# Altium schematic sheet USB_Serial_Quad.SchDoc: Kasli-DIOT
size 420 x 297 mm; EDA_Number: ARTIQ; Projet: ARTIQ/SINARA; Author: G.Kasprowicz; CompanyName: WUT ISE; DrawnBy: F.Świtakowski; Organization: WUT ISE; Address1: PW ISE; Address2: Nowowiejska 15/19 00-665 Warsaw; Address3: gkasprow@gmail.com; DocumentNumber: 9; SheetNumber: 9; SheetTotal: 16; ModifiedBy: -; CheckedDate: -; Title2: USB_Serial_Quad; DivGrp: WUT ISE; Designer: F.Świtakowski; ModifiedDate: -; ProjectName: Sensor Box
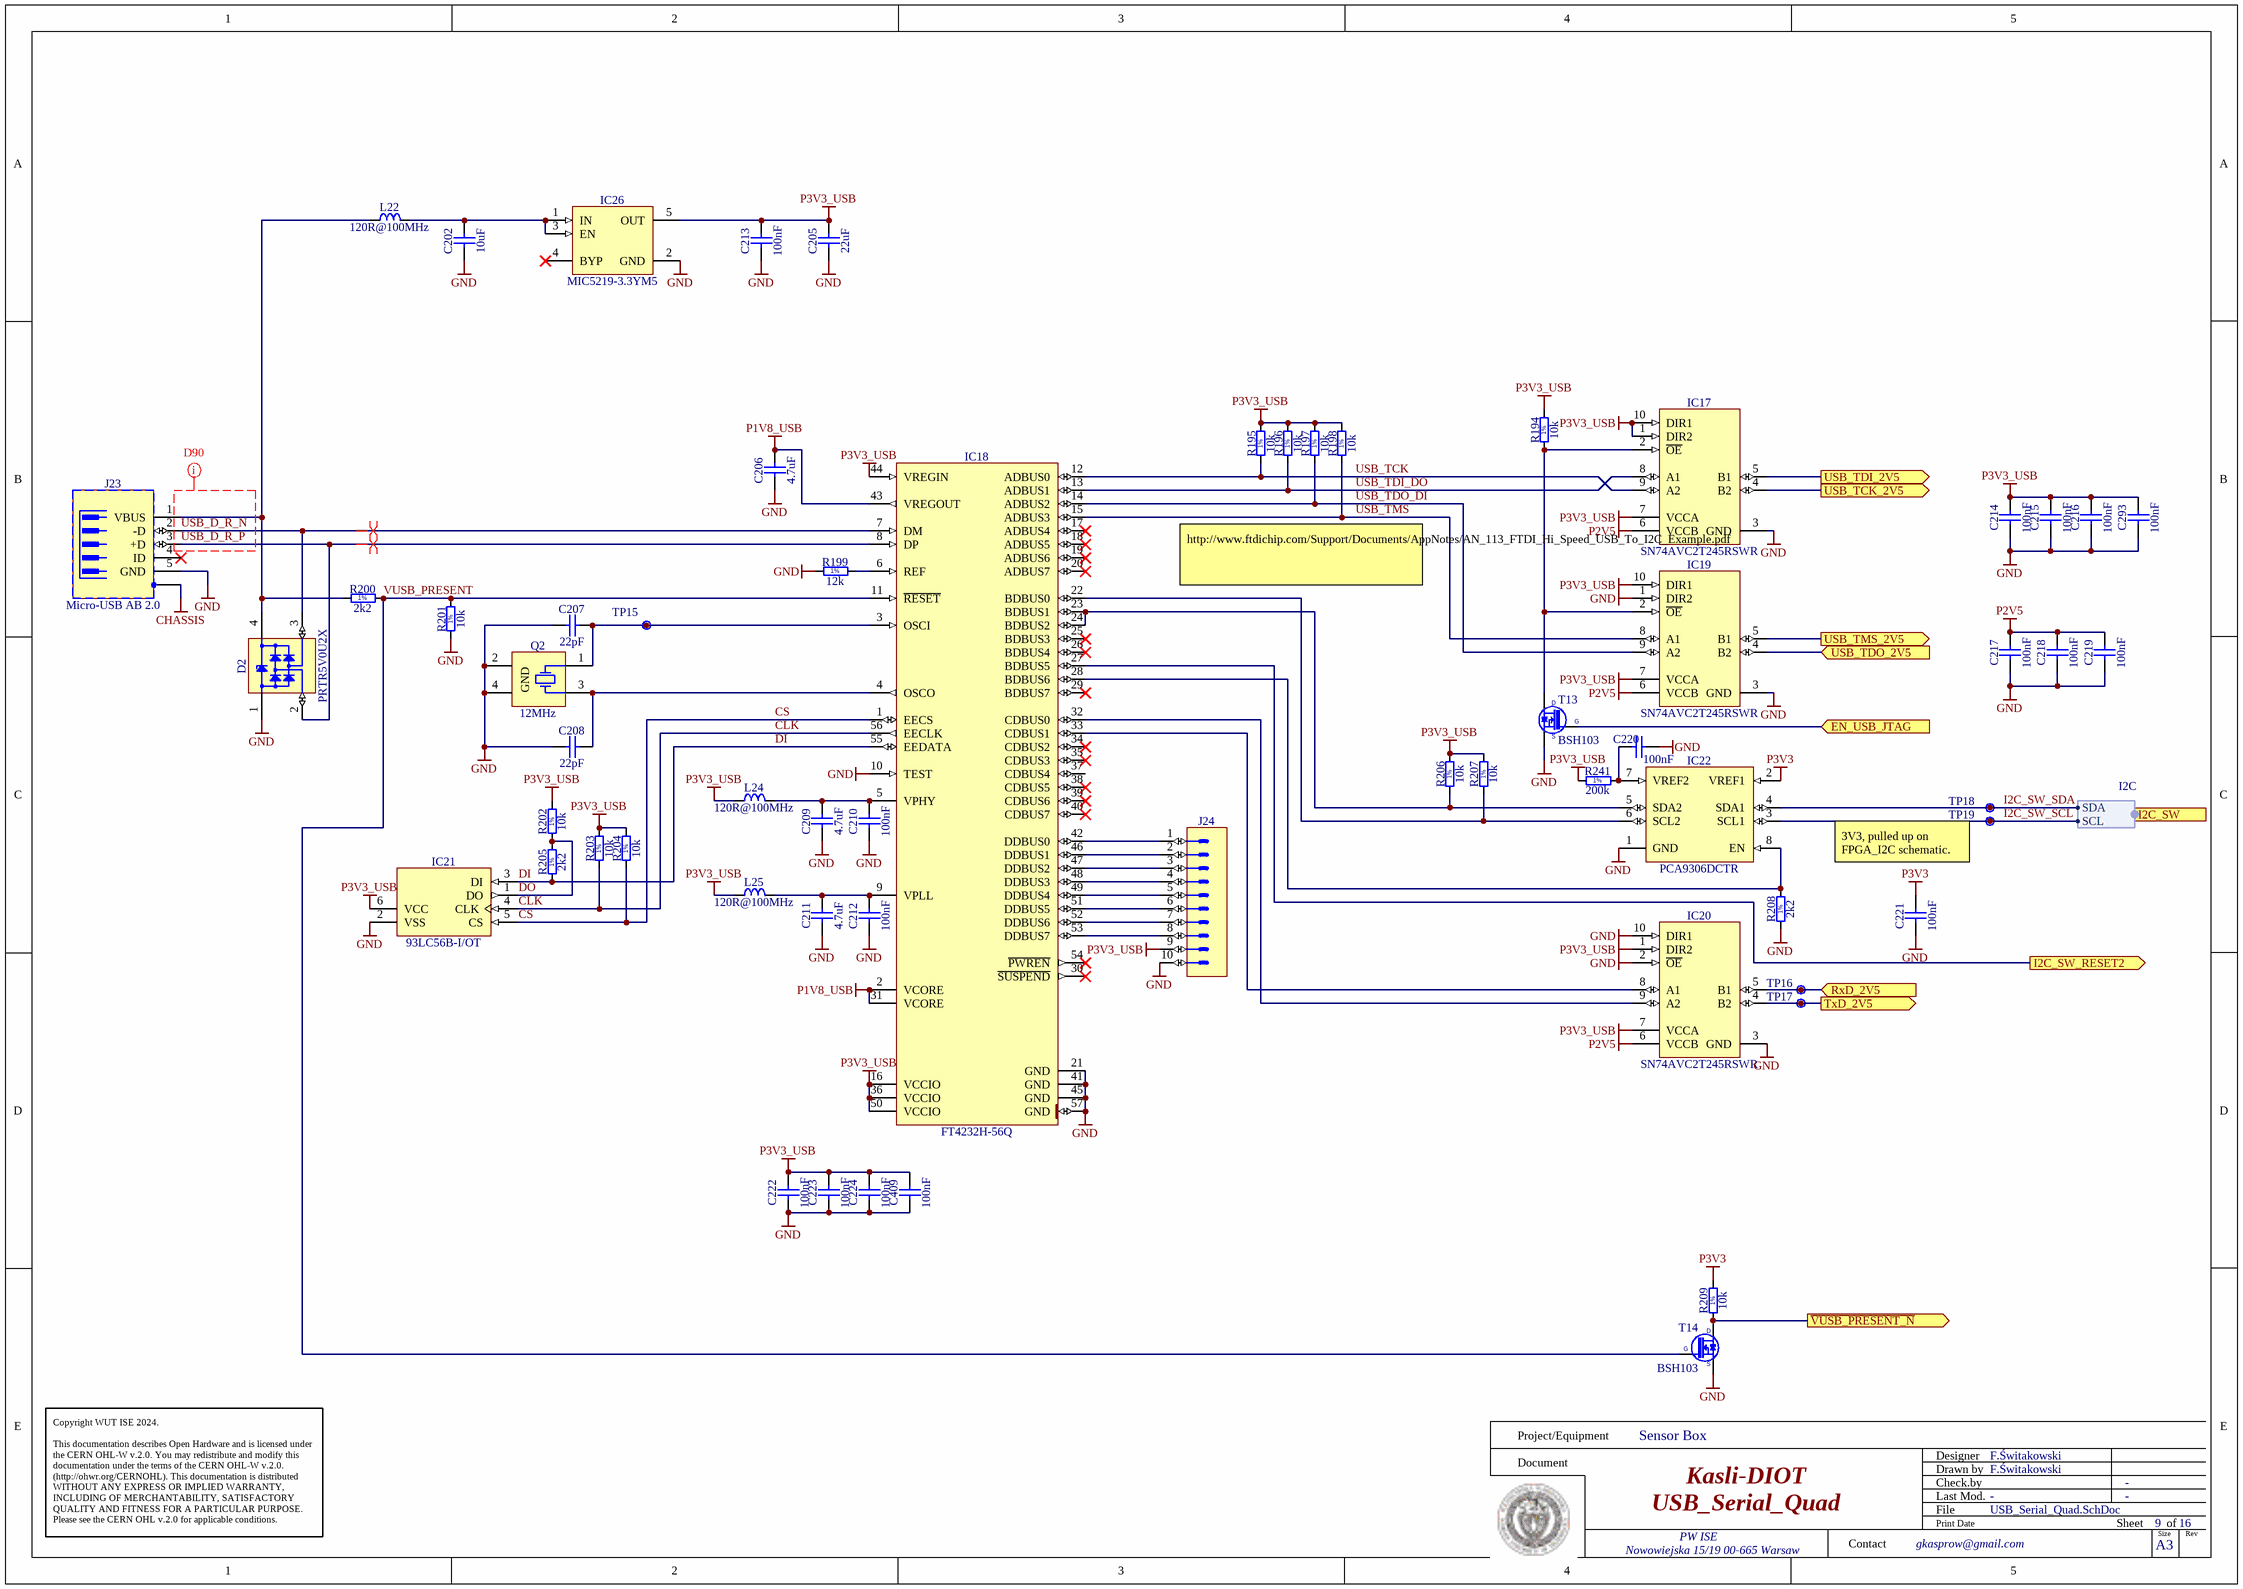
[diagram p0: USB_Serial_Quad.SchDoc]

## Parts
C202  10uF  [CAPC1608X87N]
C205  22uF  [CAPC1709X100N]
C206  4.7uF  [CAPC2012X135N]
C207  22pF  [CAPC1005X55N]
C208  22pF  [CAPC1005X55N]
C209  4.7uF  [CAPC2012X135N]
C210  100nF  [CAPC0603X33N]
C211  4.7uF  [CAPC2012X135N]
C212  100nF  [CAPC0603X33N]
C213  100nF  [CAPC1005X55N]
C214  100nF  [CAPC1005X55N]
C215  100nF  [CAPC1005X55N]
C216  100nF  [CAPC1005X55N]
C217  100nF  [CAPC1005X55N]
C218  100nF  [CAPC1005X55N]
C219  100nF  [CAPC1005X55N]
C220  100nF  [CAPC1005X55N]
C221  100nF  [CAPC1005X55N]
C222  100nF  [CAPC1005X55N]
C223  100nF  [CAPC1005X55N]
C224  100nF  [CAPC1005X55N]
C293  100nF  [CAPC1005X55N]
C409  100nF  [CAPC1005X55N]
D2  PRTR5V0U2X  [SOT190P230X110-4N]
IC17  SN74AVC2T245RSWR  [QFN40P140X180X55-10N]
IC18  FT4232H-56Q  [QFN50P800X800X100-57N-S620]
IC19  SN74AVC2T245RSWR  [QFN40P140X180X55-10N]
IC20  SN74AVC2T245RSWR  [QFN40P140X180X55-10N]
IC21  93LC56B-I/OT  [SOT95P270X145-6N]
IC22  PCA9306DCTR  [SOP65P400X130-8N]
IC26  MIC5219-3.3YM5  [SOT95P280X145-5N]
J23  Micro-USB AB 2.0  [HIROSE_ZX62RD-AB-5P8]
J24  Header 10  [SAMTEC_TSW-105-07-L-D-LL]  (value not drawn)
L22  120R@100MHz  [INDC1608X65N]
L24  120R@100MHz  [INDC1608X65N]
L25  120R@100MHz  [INDC1608X65N]
Q2  12MHz  [XTAL_TXC_7M]
R194  10k  [RESC1005X40N]
R195  10k  [RESC1005X40N]
R196  10k  [RESC1005X40N]
R197  10k  [RESC1005X40N]
R198  10k  [RESC1005X40N]
R199  12k  [RESC1005X40N]
R200  2k2  [RESC1005X40N]
R201  10k  [RESC1005X40N]
R202  10k  [RESC1005X40N]
R203  10k  [RESC1005X40N]
R204  10k  [RESC1005X40N]
R205  2k2  [RESC1005X40N]
R206  10k  [RESC1005X40N]
R207  10k  [RESC1005X40N]
R208  2k2  [RESC1005X40N]
R209  10k  [RESC1005X40N]
R241  200k  [RESC1005X40N]
T13  BSH103  [SOT95P230X110-3N]
T14  BSH103  [SOT95P230X110-3N]
TP15  Test Point  [TPS127]  (value not drawn)  (no BOM)
TP16  Test Point  [TPS127]  (value not drawn)  (no BOM)
TP17  Test Point  [TPS127]  (value not drawn)  (no BOM)
TP18  Test Point  [TPS127]  (value not drawn)  (no BOM)
TP19  Test Point  [TPS127]  (value not drawn)  (no BOM)

## Ports
EN_USB_JTAG (in), I2C_SW (harness i2C), I2C_SW_RESET2 (out), RxD_2V5 (in), TxD_2V5 (out), USB_TCK_2V5 (out), USB_TDI_2V5 (out), USB_TDO_2V5 (in), USB_TMS_2V5 (out), ~{VUSB_PRESENT_N} (out)

## Harnesses
I2C: SDA, SCL

## Nets
CHASSIS: J23.6(SH)
GND: C202.1 C205.1 C206.1 C207.1 C208.1 C209.1 C210.1 C211.1 C212.1 C213.1 C214.1 C215.1 C216.1 C217.1 C218.1 C219.1 C220.2 C221.1 C222.1 C223.1 C224.1 C293.1 C409.1 D2.1(GND) IC17.3(GND) IC18.10(TEST) IC18.21(GND) IC18.41(GND) IC18.45(GND) IC18.57(GND) IC19.1(DIR2) IC19.3(GND) IC20.2(~{OE}) IC20.3(GND) IC20.10(DIR1) IC21.2(VSS) IC22.1(GND) IC26.2(GND) J23.5(GND) J24.10 Q2.2(GND) Q2.4(GND) R199.1 R201.1 R208.1 T13.2(S) T14.2(S)
P1V8_USB: C206.2 IC18.2(VCORE) IC18.31(VCORE) IC18.43(VREGOUT)
P2V5: C217.2 C218.2 C219.2 IC17.6(VCCB) IC19.6(VCCB) IC20.6(VCCB)
P3V3: C221.2 IC22.2(VREF1) R209.2
P3V3_USB: C205.2 C213.2 C214.2 C215.2 C216.2 C222.2 C223.2 C224.2 C293.2 C409.2 IC17.1(DIR2) IC17.7(VCCA) IC17.10(DIR1) IC18.16(VCCIO) IC18.36(VCCIO) IC18.44(VREGIN) IC18.50(VCCIO) IC19.7(VCCA) IC19.10(DIR1) IC20.1(DIR2) IC20.7(VCCA) IC21.6(VCC) IC26.5(OUT) J24.9 L24.1 L25.1 R194.2 R195.2 R196.2 R197.2 R198.2 R202.2 R203.2 R204.2 R206.2 R207.2 R241.1
~{VUSB_PRESENT_N}: R209.1 T14.3(D) ; port ~{VUSB_PRESENT_N}
CLK: IC18.56(EECLK) IC21.4(CLK) R203.1
CS: IC18.1(EECS) IC21.5(CS) R204.1
DI: IC18.55(EEDATA) IC21.3(DI) R205.2
DO: IC21.1(DO) R202.1 R205.1
EN_USB_JTAG: T13.1(G) ; port EN_USB_JTAG
I2C_SW_RESET2: IC18.27(BDBUS5) ; port I2C_SW_RESET2
I2C_SW_SCL: IC22.3(SCL1) TP19.1 ; port I2C_SW.SCL
I2C_SW_SDA: IC22.4(SDA1) TP18.1 ; port I2C_SW.SDA
RxD_2V5: IC20.5(B1) TP16.1 ; port RxD_2V5
TxD_2V5: IC20.4(B2) TP17.1 ; port TxD_2V5
USB_D_R_N: D2.3(I/O2) IC18.7(DM) J23.2(-D)
USB_D_R_P: D2.2(I/O1) IC18.8(DP) J23.3(+D)
USB_TCK: IC17.9(A2) IC18.12(ADBUS0) R195.1
USB_TCK_2V5: IC17.4(B2) ; port USB_TCK_2V5
USB_TDI_2V5: IC17.5(B1) ; port USB_TDI_2V5
USB_TDI_DO: IC17.8(A1) IC18.13(ADBUS1) R196.1
USB_TDO_2V5: IC19.4(B2) ; port USB_TDO_2V5
USB_TDO_DI: IC18.14(ADBUS2) IC19.9(A2) R197.1
USB_TMS: IC18.15(ADBUS3) IC19.8(A1) R198.1
USB_TMS_2V5: IC19.5(B1) ; port USB_TMS_2V5
VUSB_PRESENT: IC18.11(~{RESET}) R200.2 R201.2 T14.1(G)
NetC202_2: C202.2 IC26.1(IN) IC26.3(EN) L22.2
NetC207_2: C207.2 IC18.3(OSCI) Q2.1(X) TP15.1
NetC208_2: C208.2 IC18.4(OSCO) Q2.3(X)
NetC209_2: C209.2 C210.2 IC18.5(VPHY) L24.2
NetC211_2: C211.2 C212.2 IC18.9(VPLL) L25.2
NetC220_1: C220.1 IC22.7(VREF2) R241.2
NetD2_4: D2.4(VCC) J23.1(VBUS) L22.1 R200.1
NetIC17_2: IC17.2(~{OE}) IC19.2(~{OE}) R194.1 T13.3(D)
NetIC18_6: IC18.6(REF) R199.2
NetIC18_22: IC18.22(BDBUS0) IC22.6(SCL2) R207.1
NetIC18_23: IC18.23(BDBUS1) IC18.24(BDBUS2) IC22.5(SDA2) R206.1
NetIC18_28: IC18.28(BDBUS6) IC22.8(EN) R208.2
NetIC18_32: IC18.32(CDBUS0) IC20.9(A2)
NetIC18_33: IC18.33(CDBUS1) IC20.8(A1)
NetIC18_42: IC18.42(DDBUS0) J24.1
NetIC18_46: IC18.46(DDBUS1) J24.2
NetIC18_47: IC18.47(DDBUS2) J24.3
NetIC18_48: IC18.48(DDBUS3) J24.4
NetIC18_49: IC18.49(DDBUS4) J24.5
NetIC18_51: IC18.51(DDBUS5) J24.6
NetIC18_52: IC18.52(DDBUS6) J24.7
NetIC18_53: IC18.53(DDBUS7) J24.8

Not connected (* = marked no-connect by the designer): IC18 17(ADBUS4)* 18(ADBUS5)* 19(ADBUS6)* 20(ADBUS7)* 25(BDBUS3)* 26(BDBUS4)* 29(BDBUS7)* 30(~{SUSPEND})* 34(CDBUS2)* 35(CDBUS3)* 37(CDBUS4) 38(CDBUS5)* 39(CDBUS6)* 40(CDBUS7)* 54(~{PWREN})*; IC26 4(BYP)*; J23 4(ID)*

## Layout directives
net class D90: USB_D_R_N, USB_D_R_P
differential pair: USB_D_R_N, USB_D_R_P

## Notes on the sheet
- http://www.ftdichip.com/Support/Documents/AppNotes/AN_113_FTDI_Hi_Speed_USB_To_I2C_Example.pdf
- 3V3, pulled up on FPGA_I2C schematic.
- Project/Equipment
- Document
- Designer
- Drawn by
- Check.by
- Copyright WUT ISE 2024.
  This documentation describes Open Hardware and is licensed under the CERN OHL-W v.2.0. You may redistribute and modify this documentation under the terms of the CERN OHL-W v.2.0. (http://ohwr.org/CERNOHL). This documentation is distributed WITHOUT ANY EXPRESS OR IMPLIED WARRANTY, INCLUDING OF MERCHANTABILITY, SATISFACTORY QUALITY AND FITNESS FOR A PARTICULAR PURPOSE. Please see the CERN OHL v.2.0 for applicable conditions.
- Contact
- File
- Last Mod.
- Print Date
- Sheet
- Size
- A3
- of
- Rev
- (in symbol R0402_2K2_1%_0.0625W_100PPM) 1%
- (in symbol R0402_10K_1%_0.0625W_100PPM) 1%
- (in symbol R0402_12K_1%_0.0625W_100PPM) 1%
- (in symbol R0402_200K_1%_0.0625W_100PPM) 1%

## Library data of the parts
C202 = CC0603_10UF_6.3V_20%_X5R: Non-polarised capacitor; Part Description: SMD Multilayer Chip Ceramic Capacitor; Manufacturer: GENERIC; Manufacturer1 Part Number: C0603C106M9PAC; Voltage: 6.3V; TC: X5R; Tolerance: ±20%; Part Number: CC0603_10UF_6.3V_20%_X5R; Component Kind: Standard; Component Type: Standard; Pin Count: 2; Value: 10uF; Status: Preferred; Manufacturer Part Number: CC0603_10uF_6.3V_20%_X5R; Case: 0603; Mounted: Yes; Socket: No; SMD: Yes; Sense: No; Manufacturer1 Example: KEMET; Manufacturer1 ComponentHeight: 0.95mm; HelpURL: \\cern.ch\dfs\Applications\Altium\Datasheets\CC0603_X5R_KEMET.pdf; Author: CERN DEM JLC; CreateDate: 2007-12-03; LatestRevisionDate: 2007-12-03
C205 = CC0603_22UF_6.3V_20%_X5R: Non-polarised capacitor; Part Description: SMD Multilayer Chip Ceramic Capacitor; Manufacturer: GENERIC; Manufacturer1 Part Number: C1608X5R0J226M080AC; Voltage: 6.3V; TC: X5R; Tolerance: ±20%; Part Number: CC0603_22UF_6.3V_20%_X5R; Component Kind: Standard; Component Type: Standard; Pin Count: 2; Value: 22uF; Status: None; Manufacturer Part Number: CC0603_22UF_6.3V_20%_X5R; Case: 0603; Mounted: Yes; Socket: No; SMD: Yes; Sense: No; Manufacturer1 Example: TDK; Manufacturer1 ComponentHeight: 1mm; HelpURL: \\cern.ch\dfs\Applications\Altium\Datasheets\CC0603_X5R_TDK_C.pdf; Author: CERN DEM JLC; CreateDate: 16.12.2013; LatestRevisionDate: 13.09.2016; ClassName: Artix
C206 C209 C211 = CC0805_4.7UF_10V_10%_X5R: Non-polarised capacitor; Part Description: SMD Multilayer Chip Ceramic Capacitor; Manufacturer: GENERIC; Manufacturer1 Part Number: 222224013672; Voltage: 10V; TC: X5R; Tolerance: ±10%; Part Number: CC0805_4.7UF_10V_10%_X5R; Component Kind: Standard; Component Type: Standard; Pin Count: 2; Value: 4.7uF; Status: Preferred; Manufacturer Part Number: CC0805_4.7UF_10V_10%_X5R; Case: 0805; Mounted: Yes; Socket: No; SMD: Yes; Sense: No; Manufacturer1 Example: PHYCOMP; Manufacturer1 ComponentHeight: 1.45mm; HelpURL: \\cern.ch\dfs\Applications\Altium\Datasheets\CC0805_X5R_PHYCOMP_HC.pdf; Author: CERN DEM JLC; CreateDate: 03.12.2007; LatestRevisionDate: 03.12.2007
C207 C208 = CC0402_22PF_50V_5%_C0G: Non-polarised capacitor; Part Description: SMD Multilayer Chip Ceramic Capacitor; Manufacturer: GENERIC; Manufacturer1 Part Number: C0402C220J5GACTU; Voltage: 50V; TC: C0G/NP0; Tolerance: ±5%; Part Number: CC0402_22PF_50V_5%_C0G; Component Kind: Standard; Component Type: Standard; Pin Count: 2; Value: 22pF; Status: Preferred; Manufacturer Part Number: CC0402_22PF_50V_5%_C0G; Case: 0402; Mounted: Yes; Socket: No; SMD: Yes; Sense: No; Manufacturer1 Example: KEMET; Manufacturer1 ComponentHeight: 0.55mm; HelpURL: \\cern.ch\dfs\Applications\Altium\Datasheets\CC0805_C0G_KEMET_(Commercial Grade).pdf; Author: CERN DEM JLC; CreateDate: 03.12.2007; LatestRevisionDate: 03.12.2007
C210 C212 = CC0201_100NF_6.3V_10%_X5R: Non-polarised capacitor; Part Description: SMD Multilayer Chip Ceramic Capacitor; Manufacturer: GENERIC; Manufacturer1 Part Number: 02016D104KAT2A; Voltage: 6.3V; TC: X5R; Tolerance: ±10%; Part Number: CC0201_100NF_6.3V_10%_X5R; Component Kind: Standard; Component Type: Standard; Pin Count: 2; Value: 100nF; Status: Not Recommended; Manufacturer Part Number: CC0201_100NF_6.3V_10%_X5R; Case: 0201; Mounted: Yes; Socket: No; SMD: Yes; Sense: No; Manufacturer1 Example: AVX; Manufacturer1 ComponentHeight: 0.33mm; HelpURL: \\cern.ch\dfs\Applications\Altium\Datasheets\CC0201_X5R_AVX.pdf; Author: CERN DEM JLC; CreateDate: 03.12.2007; LatestRevisionDate: 03.12.2007
C213-C224 C293 C409 = CC0402_100NF_16V_10%_X7R: Non-polarised capacitor; Part Description: SMD Multilayer Chip Ceramic Capacitor; Manufacturer: GENERIC; Manufacturer1 Part Number: GRM155R71C104KA88D; Voltage: 16V; TC: X7R; Tolerance: ±10%; Part Number: CC0402_100NF_16V_10%_X7R; Component Kind: Standard; Component Type: Standard; Pin Count: 2; Value: 100nF; Status: Not Recommended; Manufacturer Part Number: CC0402_100NF_16V_10%_X7R; Case: 0402; Mounted: Yes; Socket: No; SMD: Yes; Sense: No; Manufacturer1 Example: MURATA; Manufacturer1 ComponentHeight: 0.55mm; HelpURL: \\cern.ch\dfs\Applications\Altium\Datasheets\CC0402_X7R_MURATA_GRM.pdf; Author: CERN DEM JLC; CreateDate: 05/12/2013; LatestRevisionDate: 03/12/2007
D2 = PRTR5V0U2X: Ultra Low Capacitance Double Rail-to-Rail ESD Protection Diode; Part Description: Ultra Low Capacitance (1pF) Double Rail-to-Rail ESD Protection Diode (8kV); Manufacturer: NXP SEMICONDUCTORS; Voltage: 5.5V; PressFit: No; Bonding: No; Part Number: PRTR5V0U2X; Component Kind: Standard; Component Type: Standard; Device: PRTR5V0U2X; PackageDescription: SOT143B, SOT, 1.90mm Pitch; 4 Pin, 1.30mm W X 2.90mm L X 1.10mm H body, IPC Medium Density; Manufacturer Part Number: PRTR5V0U2X; Pin Count: 4; Case: SOT143B; Mounted: Yes; Socket: No; SMD: Yes; Sense: No; ComponentHeight: 1.1mm; HelpURL: \\cern.ch\dfs\Applications\Altium\Datasheets\PRTR5V0U2X.pdf; Author: CERN DEM JLC; CreateDate: 22.03.2011; LatestRevisionDate: 22.03.2011
IC17 IC19 IC20 = SN74AVC2T245RSWR: Dual-Bit Dual-Supply Bus Transceiver With Configurable Voltage Translation and 3-State Outputs; Manufacturer: TEXAS INSTRUMENTS; PressFit: No; Bonding: No; Part Number: SN74AVC2T245RSWR; Component Kind: Standard; Component Type: Standard; Device: SN74AVC2T245RSWR; PackageDescription: QFN, 0.40mm Pitch, Rect.;10 Pin, 1.80mm L X 1.40mm W X 0.55mm H Body, IPC Medium Density; Status: Not Recommended; Part Description: Dual-Bit Dual-Supply Bus Transceiver With Configurable Voltage Translation and 3-State Outputs; Manufacturer Part Number: SN74AVC2T245RSWR; Pin Count: 10; Case: QFN10; Mounted: Yes; Socket: No; SMD: Yes; Sense: No; ComponentHeight: 0.55mm; Author: CERN DEM JLC; HelpURL: \\cern.ch\dfs\Applications\Altium\Datasheets\SN74AVC2T245RSWR.pdf; CreateDate: 07.07.2014; LatestRevisionDate: 30.03.2017
IC18 = FT4232H-56Q: Quad High Speed USB to Multipurpose UART/MPSSE IC; Manufacturer: FUTURE TECHNOLOGY DEVICES INTERNATIONAL (FTDI); PressFit: No; Bonding: No; Part Number: FT4232H-56Q; Component Kind: Standard; Component Type: Standard; Device: FT4232H-56Q; PackageDescription: QFN, 0.50mm Pitch, Square; 56 Pin, 8.00mm L X 8.00mm W X 1.00mm H body (6.1mm X 6.1mm Thermal tab), IPC Medium Density; Part Description: Quad High Speed USB to Multipurpose UART/MPSSE IC; Manufacturer Part Number: FT4232H-56Q; Pin Count: 57; Case: QFN56; Mounted: Yes; Socket: No; SMD: Yes; Sense: No; ComponentHeight: 1mm; Author: CERN DEM JLC; HelpURL: \\cern.ch\dfs\Applications\Altium\Datasheets\FT4232H-56Q.pdf; CreateDate: 11.10.2016; LatestRevisionDate: 11.10.2016
IC21 = 93LC56B-I/OT: 2K Microwire Compatible Serial EEPROM; Part Description: 2K, 128X16-bit, 2.5V Microwire Compatible Serial EEPROM; Manufacturer: MICROCHIP TECHNOLOGY; PressFit: No; Bonding: No; Part Number: 93LC56B-I/OT; Component Kind: Standard; Component Type: Standard; Device: 93LC56B-I/OT; PackageDescription: SOT, 0.95mm Pitch; 6 Pin,1.55mm W X 2.90mm L X 1.45mm H body, IPC Medium Density; Manufacturer Part Number: 93LC56B-I/OT; Pin Count: 6; Case: SOT23-6; Mounted: Yes; Socket: No; SMD: Yes; Sense: No; ComponentHeight: 1.45mm; HelpURL: \\cern.ch\dfs\Applications\Altium\Datasheets\93LC56B-IOT.pdf; Author: CERN DEM BC; CreateDate: 06.04.2018; LatestRevisionDate: 06.04.2018
IC22 = PCA9306DCTR: Dual Bidirectional I2C Bus And SMBus Voltage-Level Translator; Manufacturer: TEXAS INSTRUMENTS; PressFit: No; Bonding: No; Part Number: PCA9306DCTR; Component Kind: Standard; Component Type: Standard; Device: PCA9306DCTR; PackageDescription: SOP, 0.65mm, Pitch; 8 Pin, 2.80mm W X 2.95mm L X 1.30mm H Body, PC Medium Density; Part Description: Dual Bidirectional I2C Bus And SMBus Voltage-Level Translator; Manufacturer Part Number: PCA9306DCTR; Pin Count: 8; Case: SSOP8; Mounted: Yes; Socket: No; SMD: Yes; Sense: No; ComponentHeight: 1.3mm; Author: CERN DEM JLC; HelpURL: \\cern.ch\dfs\Applications\Altium\Datasheets\PCA9306DCTR.pdf; CreateDate: 25.02.2013; LatestRevisionDate: 11.02.2016
IC26 = MIC5219-3.3YM5: 500mA Peak Output LDO Regulator; Part Description: 3.3V 500mA Peak Output Low Drop-Out  (LDO) Regulator; Manufacturer: MICROCHIP TECHNOLOGY; PressFit: No; Bonding: No; Part Number: MIC5219-3.3YM5; Component Kind: Standard; Component Type: Standard; Device: MIC5219-3.3YM5; PackageDescription: SOT, 0.95mm pitch; 5 pin, 1.60mm W X 2.90mm L X 1.45mm H body, IPC Medium Density; Manufacturer Part Number: MIC5219-3.3YM5; Pin Count: 5; Case: SOT23-5; Mounted: Yes; Socket: No; SMD: Yes; Sense: No; ComponentHeight: 1.45mm; HelpURL: \\cern.ch\dfs\Applications\Altium\Datasheets\MIC5219-3.3YM5.pdf; Author: CERN DEM WB; CreateDate: 2019-04-16; LatestRevisionDate: 2019-04-16
J23 = HIROSE_ZX62RD-AB-5P8: 5 Pin + 1 Shield USB Receptacle; Part Description: Micro-USB 2.0 Right Angle, SMD Type AB - Reverse (Top mount), Shell Through Hole; Manufacturer: HIROSE (HRS); PressFit: No; Part Number: HIROSE_ZX62RD-AB-5P8; Component Kind: Standard; Component Type: Standard; Pin Count: 7; Family: Micro-USB AB 2.0; Mounted: Yes; Socket: No; SMD: Yes; Sense: No; Status: Obsolete; Manufacturer Part Number: ZX62RD-AB-5P8; ComponentHeight: 2.35mm; HelpURL: \\cern.ch\dfs\Applications\Altium\Datasheets\HIROSE_ZX62RD-AB-5P8.pdf; ComponentLink1URL: \\cern.ch\dfs\Applications\Altium\Datasheets\HIROSE_ZX62RD-AB-5P8_Package-Drawing.pdf; ComponentLink1Description: Package-Drawing; Author: CERN DEM JLC; CreateDate: 29.10.2014; LatestRevisionDate: 22.06.2017
J24 = SAMTEC_TSW-105-07-L-D-LL: Connector 10 Male; Part Description: 10 Contacts, Pitch 2.54mm, Dual Row Through Mount  Straight Header With Locking Lead (Lead Length 2.54mm); Manufacturer: SAMTEC; PressFit: No; Part Number: SAMTEC_TSW-105-07-L-D-LL; Component Kind: Standard; Component Type: Standard; Pin Count: 10; Family: Header 10; Mounted: Yes; Socket: No; SMD: No; Sense: No; Status: None; Manufacturer Part Number: TSW-105-07-L-D-LL; ComponentHeight: 8.38mm; HelpURL: \\cern.ch\dfs\Applications\Altium\Datasheets\SAMTEC_TSW-105-07-L-D-LL.pdf; Author: CERN DEM JLC; CreateDate: 2012-01-23; LatestRevisionDate: 2012-07-26
L22 L24 L25 = IND0603_MURATA_BLM18SG121TN1D: Inductor; Part Description: SMD EMIFIL Suppression Chip Ferrite Bead; Manufacturer: MURATA; Power: 3A; Resistance: 0.025R; Tolerance: ±25%; Part Number: IND0603_MURATA_BLM18SG121TN1D; Component Kind: Standard; Component Type: Standard; Pin Count: 2; Value: 120R@100MHz; Status: None; Manufacturer Part Number: BLM18SG121TN1D; Case: 0603; Mounted: Yes; Socket: No; SMD: Yes; Sense: No; ComponentHeight: 0.65mm; HelpURL: \\cern.ch\dfs\Applications\Altium\Datasheets\IND0603_MURATA_BLM18S.pdf; Author: CERN DEM JLC; CreateDate: 23.07.2014; LatestRevisionDate: 23.07.2014
Q2 = XTAL_12MHZ_TXC_7M-12.000MAAJ-T: Crystal 4 pins 1=XTAL Control 2=GND3=XTAL 4=GND; Part Description: ±30ppm 18pF -20°C to +70°C  4 Pins, 3.2x2.5X0.8mm, SMD Sealing Crystal, 7M Series; Manufacturer: TXC CORPORATION; PressFit: No; Bonding: No; Part Number: XTAL_12MHZ_TXC_7M-12.000MAAJ-T; Component Kind: Standard; Component Type: Standard; PackageDescription: 4 Pins, 2.5x3.2mm, SMD Sealing Crystal, 7M Serie; Value: 12MHz; Manufacturer Part Number: 7M-12.000MAAJ-T; Pin Count: 4; Mounted: Yes; Socket: No; SMD: Yes; Sense: No; ComponentHeight: 0.8mm; HelpURL: \\cern.ch\dfs\Applications\Altium\Datasheets\XTAL_TXC_7M.pdf; Author: CERN DEM JLC; CreateDate: 19.06.2012; LatestRevisionDate: 19.06.2012
R194-R198 R201-R204 R206 R207 R209 = R0402_10K_1%_0.0625W_100PPM: Resistor - 1%; Part Description: General Purpose Thick Film Chip Resistor; Manufacturer: GENERIC; Manufacturer1 Part Number: 232270671003L; TC: ±100ppm/°C; PressFit: No; Part Number: R0402_10K_1%_0.0625W_100PPM; Component Kind: Standard; Component Type: Standard; Pin Count: 2; Value: 10k; Status: Not Recommended; Power: 0.0625W; Tolerance: ±1%; Manufacturer Part Number: R0402_10K_1%_0.0625W_100PPM; Case: 0402; Mounted: Yes; Socket: No; SMD: Yes; Manufacturer1 Example: YAGEO PHYCOMP; Manufacturer1 ComponentHeight: 0.4mm; HelpURL: \\cern.ch\dfs\Applications\Altium\Datasheets\R0402_Phycomp_RC0402.pdf; Author: CERN DEM JLC; CreateDate: 03.12.2007; LatestRevisionDate: 17.10.2012; Sense: No
R199 = R0402_12K_1%_0.0625W_100PPM: Resistor - 1%; Part Description: General Purpose Thick Film Chip Resistor; Manufacturer: GENERIC; Manufacturer1 Part Number: 232270671203L; TC: ±100ppm/°C; PressFit: No; Part Number: R0402_12K_1%_0.0625W_100PPM; Component Kind: Standard; Component Type: Standard; Pin Count: 2; Value: 12k; Status: Not Recommended; Power: 0.0625W; Tolerance: ±1%; Manufacturer Part Number: R0402_12K_1%_0.0625W_100PPM; Case: 0402; Mounted: Yes; Sense: No; Socket: No; SMD: Yes; Manufacturer1 Example: YAGEO PHYCOMP; Manufacturer1 ComponentHeight: 0.4mm; HelpURL: \\cern.ch\dfs\Applications\Altium\Datasheets\R0402_Phycomp_RC0402.pdf; Author: CERN DEM JLC; CreateDate: 03.12.2007; LatestRevisionDate: 17.10.2012
R200 R205 R208 = R0402_2K2_1%_0.0625W_100PPM: Resistor - 1%; Part Description: General Purpose Thick Film Chip Resistor; Manufacturer: GENERIC; Manufacturer1 Part Number: 232270672202L; TC: ±100ppm/°C; PressFit: No; Part Number: R0402_2K2_1%_0.0625W_100PPM; Component Kind: Standard; Component Type: Standard; Pin Count: 2; Value: 2k2; Status: Not Recommended; Power: 0.0625W; Tolerance: ±1%; Manufacturer Part Number: R0402_2K2_1%_0.0625W_100PPM; Case: 0402; Mounted: Yes; Sense: No; Socket: No; SMD: Yes; Manufacturer1 Example: YAGEO PHYCOMP; Manufacturer1 ComponentHeight: 0.4mm; HelpURL: \\cern.ch\dfs\Applications\Altium\Datasheets\R0402_Phycomp_RC0402.pdf; Author: CERN DEM JLC; CreateDate: 03.12.2007; LatestRevisionDate: 17.10.2012
R241 = R0402_200K_1%_0.0625W_100PPM: Resistor - 1%; Part Description: General Purpose Thick Film Chip Resistor; Manufacturer: GENERIC; Manufacturer1 Part Number: 232270672004L; TC: ±100ppm/°C; PressFit: No; Part Number: R0402_200K_1%_0.0625W_100PPM; Component Kind: Standard; Component Type: Standard; Pin Count: 2; Value: 200k; Status: Not Recommended; Power: 0.0625W; Tolerance: ±1%; Manufacturer Part Number: R0402_200K_1%_0.0625W_100PPM; Case: 0402; Mounted: Yes; Sense: No; Socket: No; SMD: Yes; Manufacturer1 Example: YAGEO PHYCOMP; Manufacturer1 ComponentHeight: 0.4mm; HelpURL: \\cern.ch\dfs\Applications\Altium\Datasheets\R0402_Phycomp_RC0402.pdf; Author: CERN DEM JLC; CreateDate: 03.12.2007; LatestRevisionDate: 17.10.2012
T13 T14 = BSH103: N-CHANNEL MOSFET WITH DIODE; Part Description: 30V 850mA N-Channel Enhancement Mode Field-Effect Transistor; Manufacturer: NEXPERIA; PressFit: No; Bonding: No; Part Number: BSH103; Component Kind: Standard; Component Type: Standard; Device: BSH103; PackageDescription: SOT23, 3 pin, Pitch 0.95mm - 1.3mm W X 2.9mm L X 1.1mm H, IPC Medium Density; Manufacturer Part Number: BSH103; Pin Count: 3; Case: SOT23-3; Mounted: Yes; Socket: No; SMD: Yes; Sense: No; ComponentHeight: 1.1mm; HelpURL: \\cern.ch\dfs\Applications\Altium\Datasheets\BSH103.pdf; Author: CERN DEM JLC; CreateDate: 16.03.2010; LatestRevisionDate: 20.06.2017
TP15-TP19 = SMD_PAD_1.27X1.27MM: Part Description: 1.27mm x 1.27mm PCB Copper Area (SMD Test Point); Mounted: No; Part Number: SMD_PAD_1.27X1.27MM; Component Type: Standard (No BOM); Pin Count: 1; Family: Test Point; Socket: No; SMD: Yes; Sense: No; Status: None; ComponentHeight: 0mm; HelpURL: Undefined; Author: CERN DEM JLC; CreateDate: 12.01.2008; LatestRevisionDate: 12.01.2008; PackageDescription: 1.27mm x 1.27mm PCB Copper Area (SMD Test Point)